# Altium schematic sheet Kanaloa_v2.0.0_GPIO.SchDoc
size A
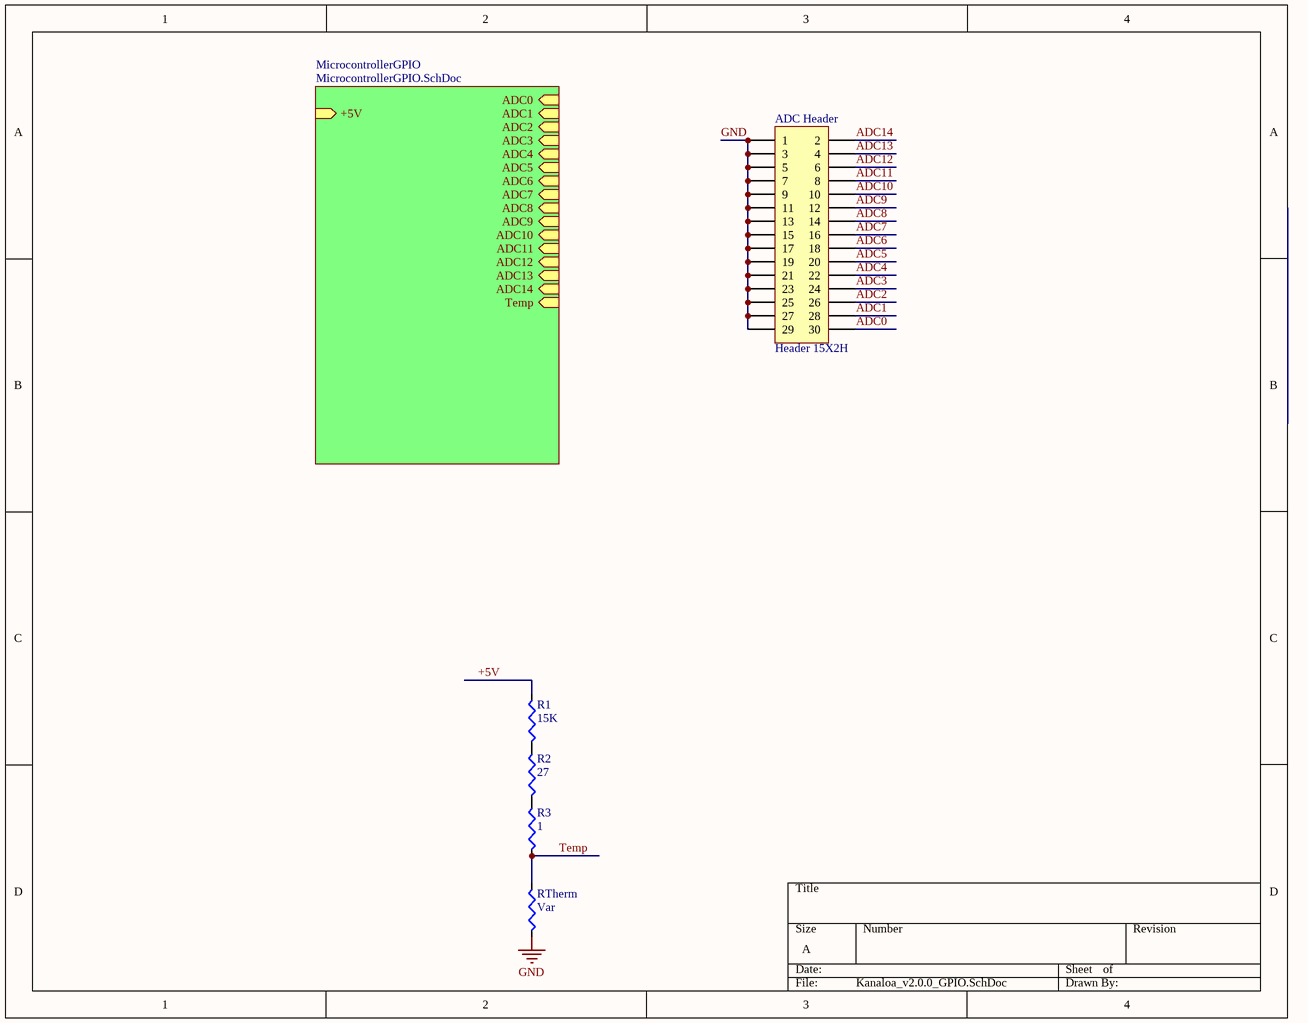
[diagram p0: Kanaloa_v2.0.0_GPIO.SchDoc]

## Parts
ADC_Header  Header 15X2H  [HDR2X15H]
R1  15K  [R 0805 (2012) RESISTOR]
R2  27  [R 0805 (2012) RESISTOR]
R3  1  [R 0805 (2012) RESISTOR]
RTherm  Var  [R 0805 (2012) RESISTOR]

## Sub-sheets
MicrocontrollerGPIO = MicrocontrollerGPIO.SchDoc: ADC0 (in), ADC1 (in), ADC2 (in), ADC3 (in), ADC4 (in), ADC5 (in), ADC7 (in), ADC6 (in), ADC8 (in), ADC9 (in), ADC10 (in), ADC11 (in), ADC12 (in), ADC13 (in), ADC14 (in), Temp (in), +5V (in)

## Nets
GND: ADC_Header.1 ADC_Header.3 ADC_Header.5 ADC_Header.7 ADC_Header.9 ADC_Header.11 ADC_Header.13 ADC_Header.15 ADC_Header.17 ADC_Header.19 ADC_Header.21 ADC_Header.23 ADC_Header.25 ADC_Header.27 ADC_Header.29 RTherm.1
+5V: R1.2
ADC0: ADC_Header.30
ADC1: ADC_Header.28
ADC2: ADC_Header.26
ADC3: ADC_Header.24
ADC4: ADC_Header.22
ADC5: ADC_Header.20
ADC6: ADC_Header.18
ADC7: ADC_Header.16
ADC8: ADC_Header.14
ADC9: ADC_Header.12
ADC10: ADC_Header.10
ADC11: ADC_Header.8
ADC12: ADC_Header.6
ADC13: ADC_Header.4
ADC14: ADC_Header.2
Temp: R3.1 RTherm.2
NetR1_1: R1.1 R2.2
NetR2_1: R2.1 R3.2

## Notes on the sheet
- (near RTherm) This resistor is of the board the connection runs to the backplane

## Library data of the parts
ADC_Header = Header 15X2H: Header, 15-Pin, Dual row, Right Angle; LatestRevisionDate: 17-Jul-2002; LatestRevisionNote: Re-released for DXP Platform.; Publisher: Altium Limited
R1-R3 RTherm = Resistor: Value: 0Ohm